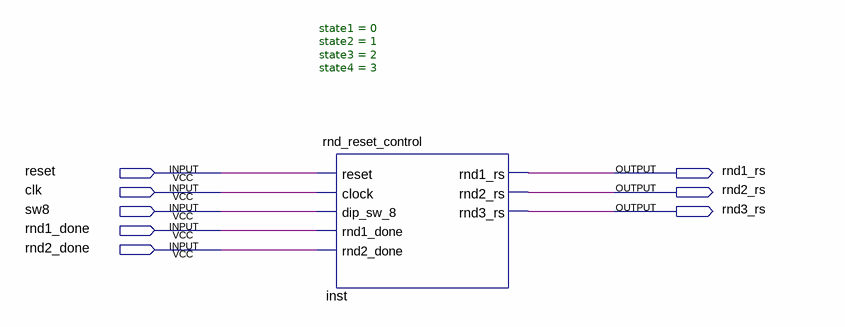
[diagram p0: schematic sheet]
// Quartus schematic reset_control_test.bdf as structural Verilog: 1 symbols, 8 pins
module reset_control_test (
  input  reset,
  input  clk,
  input  sw8,
  input  rnd1_done,
  input  rnd2_done,
  output rnd1_rs,
  output rnd2_rs,
  output rnd3_rs
);

  rnd_reset_control #(.state1(0), .state2(1), .state3(2), .state4(3)) inst (
    .reset(reset), .clock(clk), .dip_sw_8(sw8), .rnd1_done(rnd1_done), .rnd2_done(rnd2_done),
    .rnd1_rs(rnd1_rs), .rnd2_rs(rnd2_rs), .rnd3_rs(rnd3_rs));
endmodule
